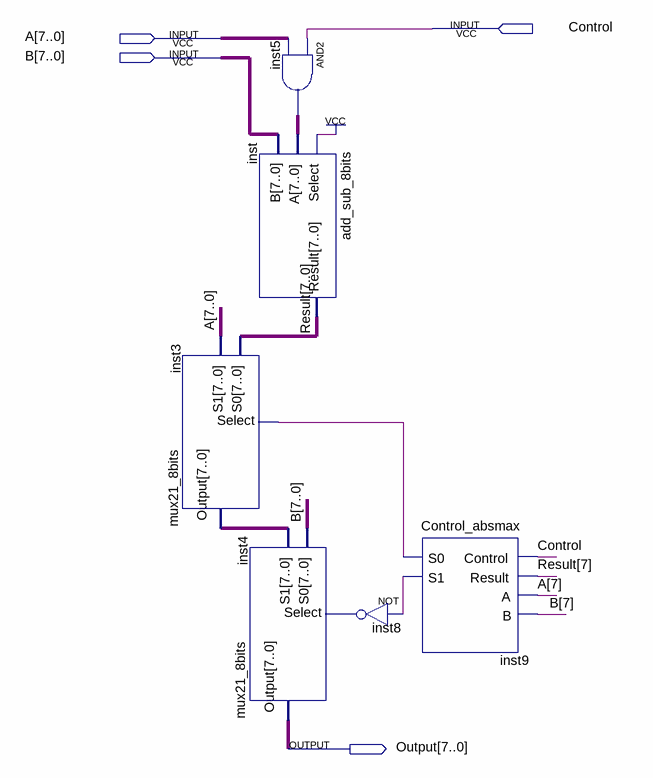
[diagram p0: schematic sheet]
// Quartus schematic abs_MAX.bdf as structural Verilog: 6 symbols, 4 pins
module abs_MAX (
  input  Control,
  input  [7:0] A,
  input  [7:0] B,
  output [7:0] Output
);

  wire inst8_out, inst9_s0, inst9_s1;
  wire [7:0] inst3_output, inst5_out, Result;

  mux21_8bits inst3 (.S0(Result), .S1(A), .Select(inst9_s0), .Output(inst3_output));
  add_sub_8bits inst (.Select(1'b1), .A(inst5_out), .B(B), .Result(Result));
  mux21_8bits inst4 (.S0(B), .S1(inst3_output), .Select(inst8_out), .Output(Output));
  assign inst5_out = {8{Control}} & A;  // AND2 inst5, 8 bits wide
  not inst8 (inst8_out, inst9_s1);
  Control_absmax inst9 (.Control(Control), .Result(Result[7]), .A(A[7]), .B(B[7]), .S0(inst9_s0), .S1(inst9_s1));
endmodule
